# EAGLE design Engi301 Project Schematic (EAGLE 8.7.1)
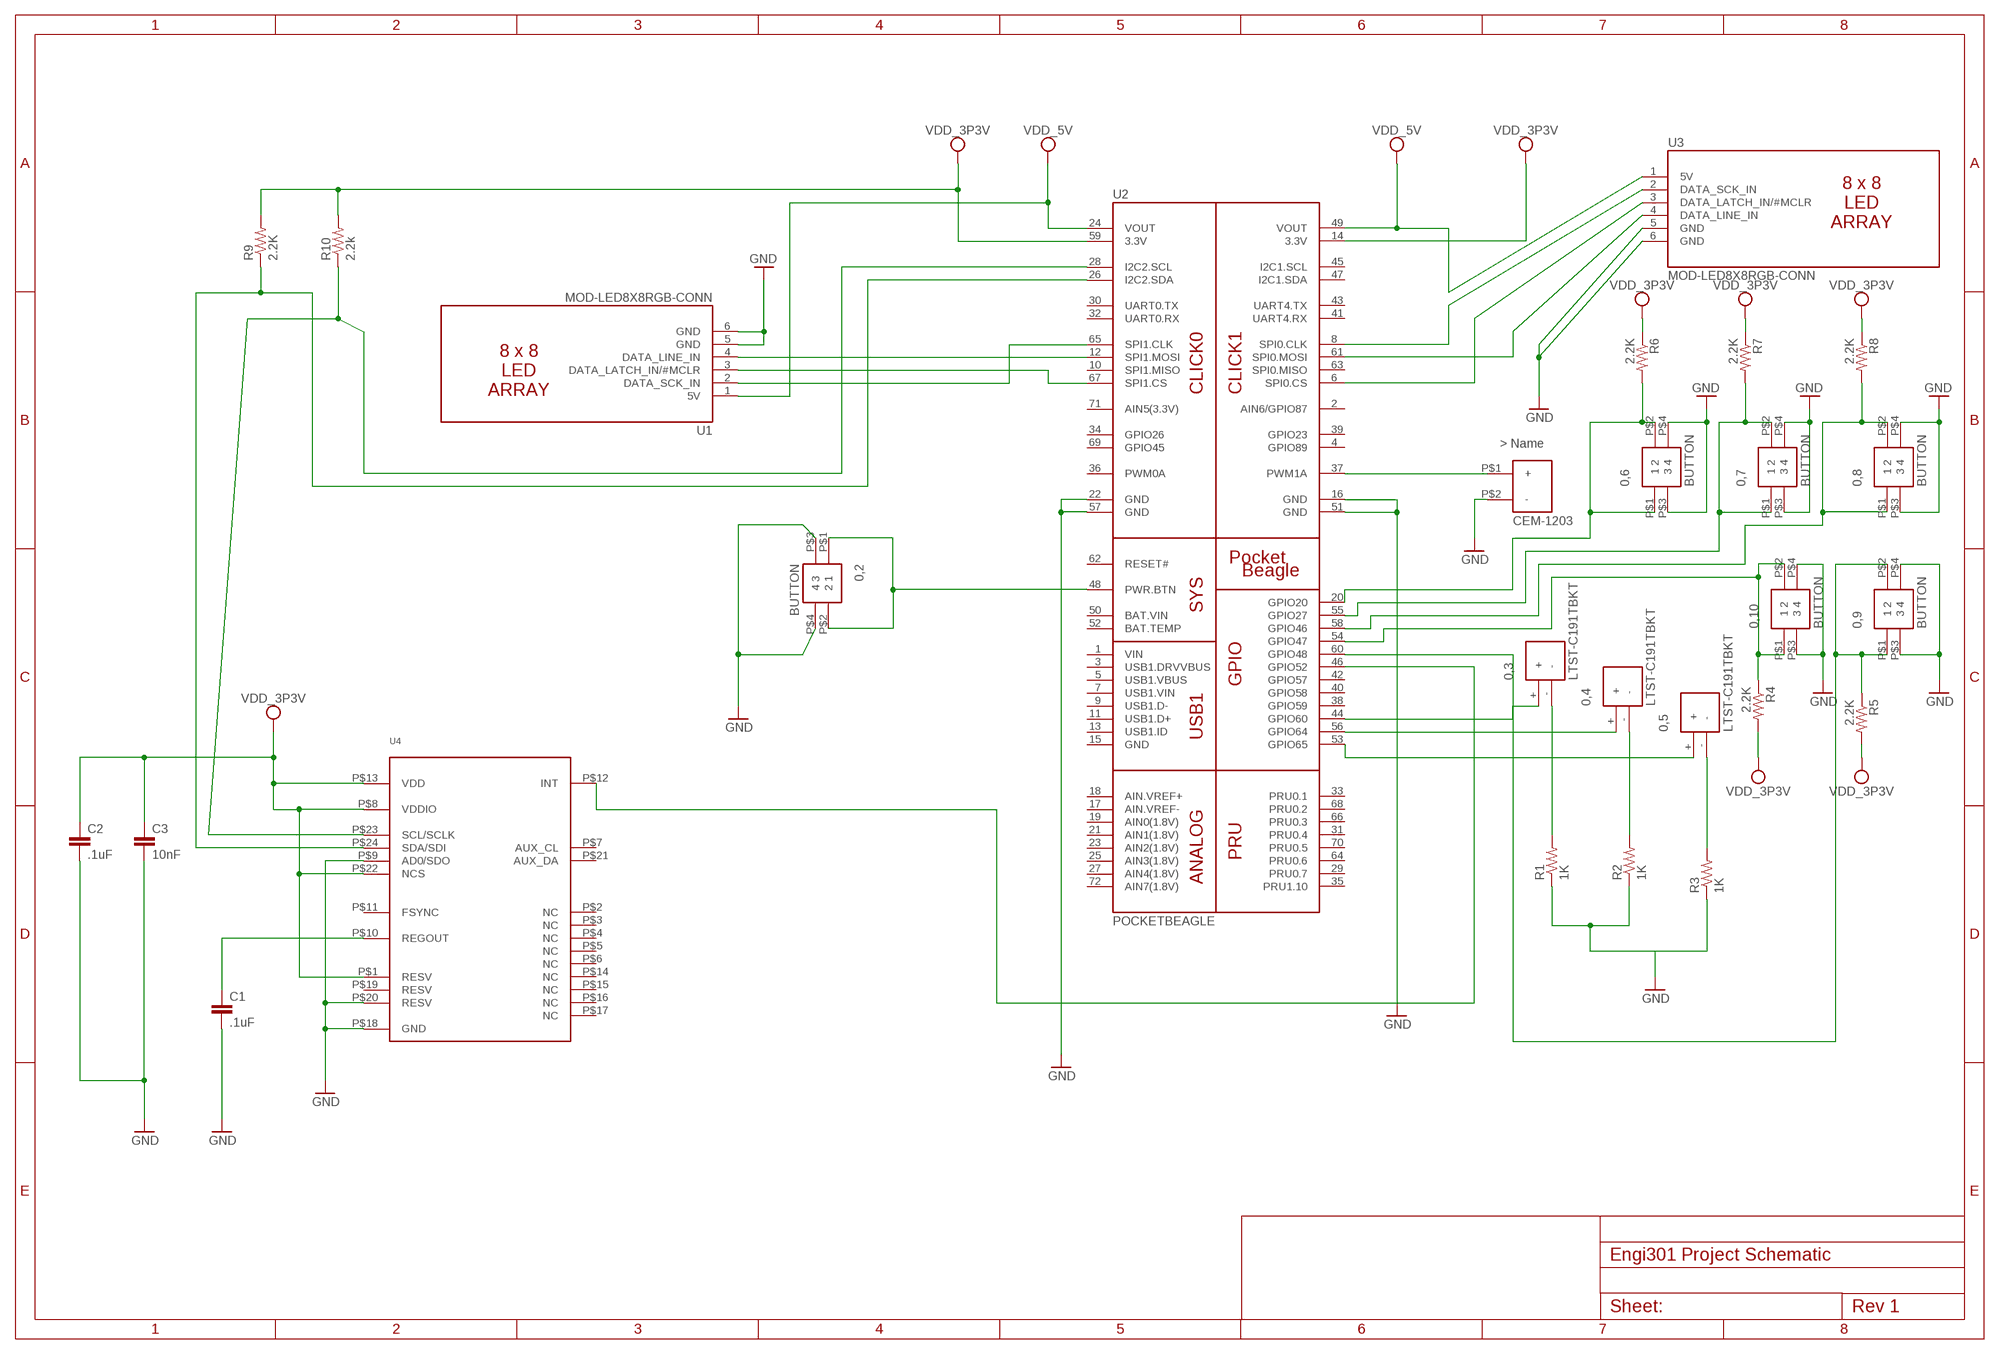
[diagram p0: schematic, sheet 1]

## Parts
0,1  CEM-1203  [CEM-1203]
0,2  BUTTON  [BUTTON]
0,3  LTST-C191TBKT  [LTST_C191TBKT]
0,4  LTST-C191TBKT  [LTST_C191TBKT]
0,5  LTST-C191TBKT  [LTST_C191TBKT]
0,6  BUTTON  [BUTTON]
0,7  BUTTON  [BUTTON]
0,8  BUTTON  [BUTTON]
0,9  BUTTON  [BUTTON]
0,10  BUTTON  [BUTTON]
C1  .1uF  C_C0603  [C0603]
C2  .1uF  C_C0603  [C0603]
C3  10nF  C_C0402  [C0402]
R1  1K  R_R0603  [R0603]
R2  1K  R_R0603  [R0603]
R3  1K  R_R0603  [R0603]
R4  2.2K  R_R0603  [R0603]
R5  2.2K  R_R0603  [R0603]
R6  2.2K  R_R0603  [R0603]
R7  2.2K  R_R0603  [R0603]
R8  2.2K  R_R0603  [R0603]
R9  2.2K  R_R0603  [R0603]
R10  2.2k  R_R0603  [R0603]
U1  MOD-LED8X8RGB-CONN  [FE06W]
U2  POCKETBEAGLE  [POCKETBEAGLE]
U3  MOD-LED8X8RGB-CONN  [FE06W]
U4  MPU-9250  [QFN_3MMX3MM]

## Nets
GND: 0,1.P$2(-) 0,2.P$3 0,2.P$4 0,6.P$3 0,6.P$4 0,7.P$3 0,7.P$4 0,8.P$3 0,8.P$4 0,9.P$3 0,9.P$4 0,10.P$3 0,10.P$4 C1.2 C2.2 C3.2 R1.1 R2.1 R3.1 U1.5(GND) U1.6(GND) U2.16(GND) U2.22(GND) U2.51(GND) U2.57(GND) U3.5(GND) U3.6(GND) U4.P$9(AD0/SDO) U4.P$18(GND) U4.P$20(RESV)
N$1: R10.1 U2.28(I2C2.SCL) U4.P$23(SCL/SCLK)
N$2: U2.8(SPI0.CLK) U3.2(DATA_SCK_IN)
N$3: U2.61(SPI0.MOSI) U3.4(DATA_LINE_IN)
N$4: C1.1 U4.P$10(REGOUT)
N$5: 0,5.+ U2.53(GPIO65)
N$6: U1.2(DATA_SCK_IN) U2.65(SPI1.CLK)
N$7: U1.4(DATA_LINE_IN) U2.12(SPI1.MOSI)
N$8: U1.3(DATA_LATCH_IN/#MCLR) U2.67(SPI1.CS)
N$9: 0,4.+ U2.56(GPIO64)
N$10: 0,3.+ U2.44(GPIO60)
N$11: 0,1.P$1(+) U2.37(PWM1A)
N$12: U2.46(GPIO52) U4.P$12(INT)
N$13: 0,2.P$1 0,2.P$2 U2.48(PWR.BTN)
N$14: 0,3.- R1.2
N$15: 0,4.- R2.2
N$16: 0,5.- R3.2
N$17: U2.6(SPI0.CS) U3.3(DATA_LATCH_IN/#MCLR)
N$18: R9.1 U2.26(I2C2.SDA) U4.P$24(SDA/SDI)
N$19: 0,6.P$1 0,6.P$2 R6.2 U2.20(GPIO20)
N$20: 0,7.P$1 0,7.P$2 R7.2 U2.55(GPIO27)
N$21: 0,8.P$1 0,8.P$2 R8.2 U2.58(GPIO46)
N$22: 0,10.P$1 0,10.P$2 R4.1 U2.54(GPIO47)
N$23: 0,9.P$1 0,9.P$2 R5.1 U2.60(GPIO48)
SYS_VDD1_3P3V: C2.1 C3.1 R4.2 R5.2 R6.1 R7.1 R8.1 R9.2 R10.2 U2.14(3.3V) U2.59(3.3V) U4.P$1(RESV) U4.P$8(VDDIO) U4.P$13(VDD) U4.P$22(NCS) ; supply symbol labelled VDD_3P3V
SYS_VDD_5V: U1.1(5V) U2.24(VOUT) U2.49(VOUT) U3.1(5V) ; supply symbol labelled VDD_5V
Unconnected: U2.1(VIN) U2.2(AIN6/GPIO87) U2.3(USB1.DRVVBUS) U2.4(GPIO89) U2.5(USB1.VBUS) U2.7(USB1.VIN) U2.9(USB1.D-) U2.10(SPI1.MISO) U2.11(USB1.D+) U2.13(USB1.ID) U2.15(GND) U2.17(AIN.VREF-) U2.18(AIN.VREF+) U2.19(AIN0(1.8V)) U2.21(AIN1(1.8V)) U2.23(AIN2(1.8V)) U2.25(AIN3(1.8V)) U2.27(AIN4(1.8V)) U2.29(PRU0.7) U2.30(UART0.TX) U2.31(PRU0.4) U2.32(UART0.RX) U2.33(PRU0.1) U2.34(GPIO26) U2.35(PRU1.10) U2.36(PWM0A) U2.38(GPIO59) U2.39(GPIO23) U2.40(GPIO58) U2.41(UART4.RX) U2.42(GPIO57) U2.43(UART4.TX) U2.45(I2C1.SCL) U2.47(I2C1.SDA) U2.50(BAT.VIN) U2.52(BAT.TEMP) U2.62(RESET#) U2.63(SPI0.MISO) U2.64(PRU0.6) U2.66(PRU0.3) U2.68(PRU0.2) U2.69(GPIO45) U2.70(PRU0.5) U2.71(AIN5(3.3V)) U2.72(AIN7(1.8V)) U4.P$2(NC) U4.P$3(NC) U4.P$4(NC) U4.P$5(NC) U4.P$6(NC) U4.P$7(AUX_CL) U4.P$11(FSYNC) U4.P$14(NC) U4.P$15(NC) U4.P$16(NC) U4.P$17(NC) U4.P$19(RESV) U4.P$21(AUX_DA)

## Library data of the parts
0,1 = ENGI301_PCB_design_project:CEM-1203
0,2 0,6-0,10 = ENGI301_PCB_design_project:BUTTON
0,3-0,5 = ENGI301_PCB_design_project:LTST-C191TBKT
C1-C3 = ENGI301_PCB_design_project:C_: Capacitor SMD. Sizes: 0402, 0603 & 0805
R1-R10 = ENGI301_design_example:R_: RESISTOR, American symbol
U1 U3 = ENGI301_PCB_design_project:MOD-LED8X8RGB-CONN
U2 = ENGI301_PCB_design_project:POCKETBEAGLE
U4 = ENGI301_PCB_design_project:MPU-9250

## Board
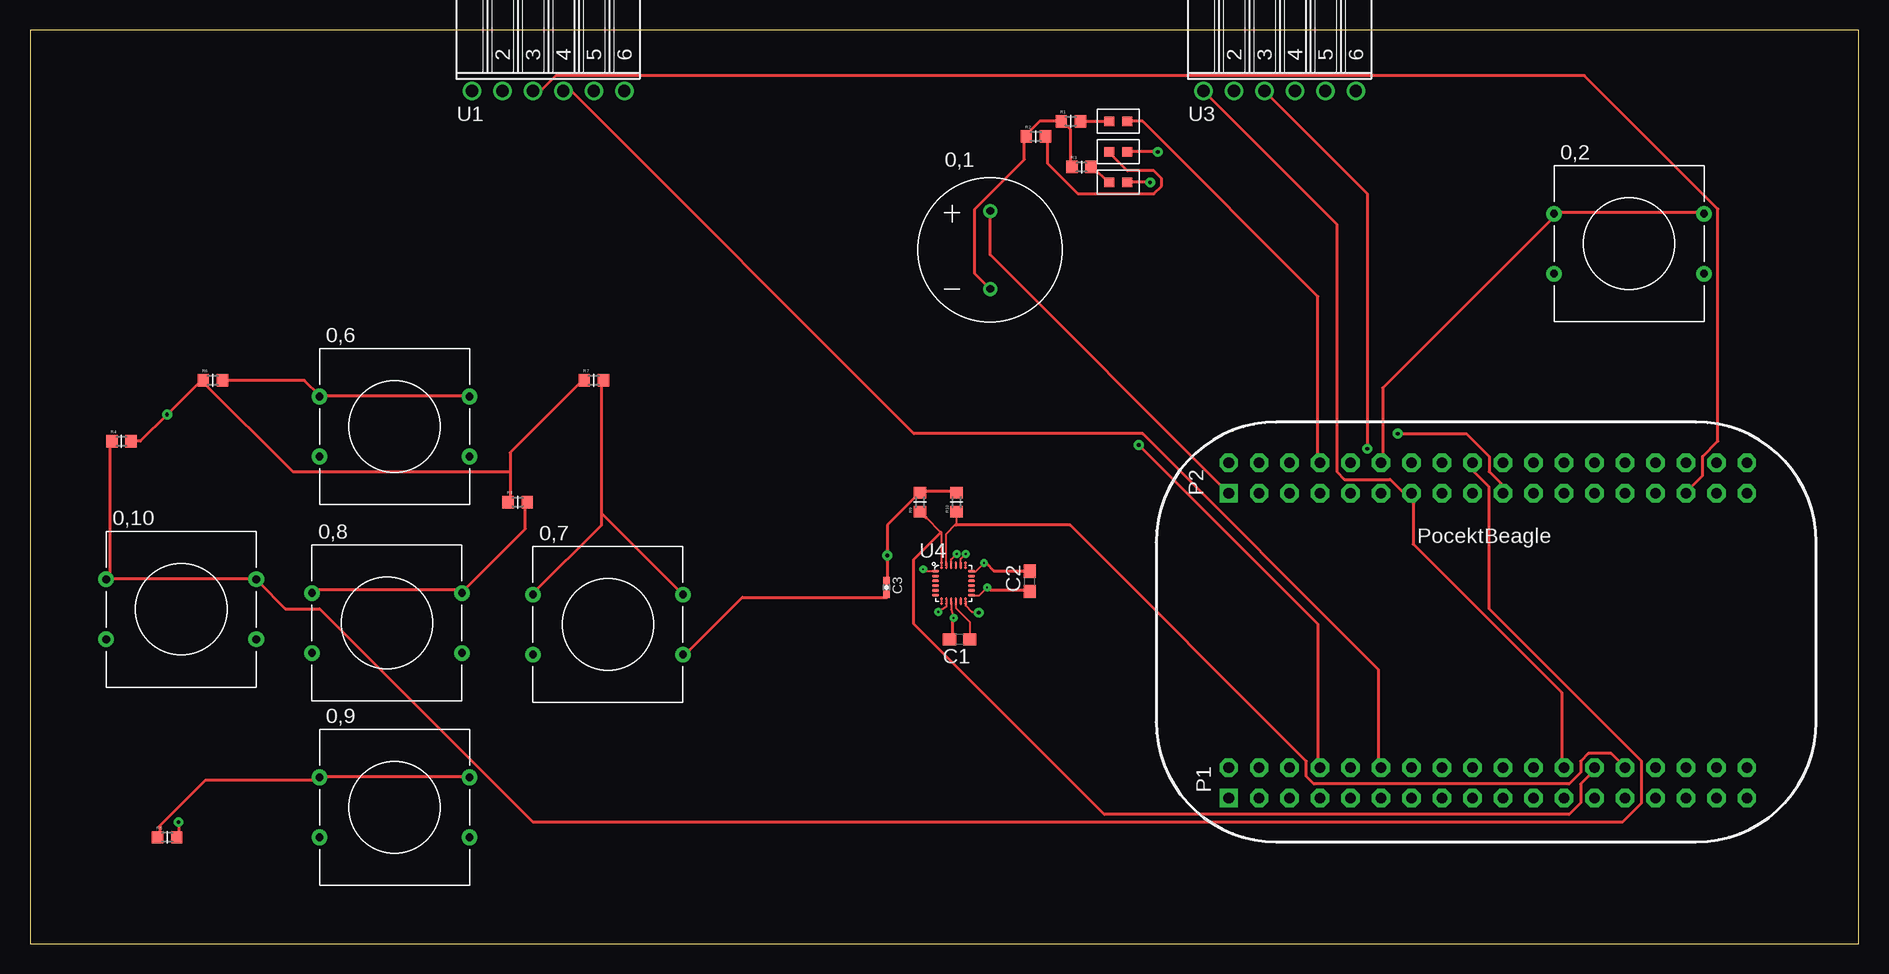
[diagram p1: board, top side]
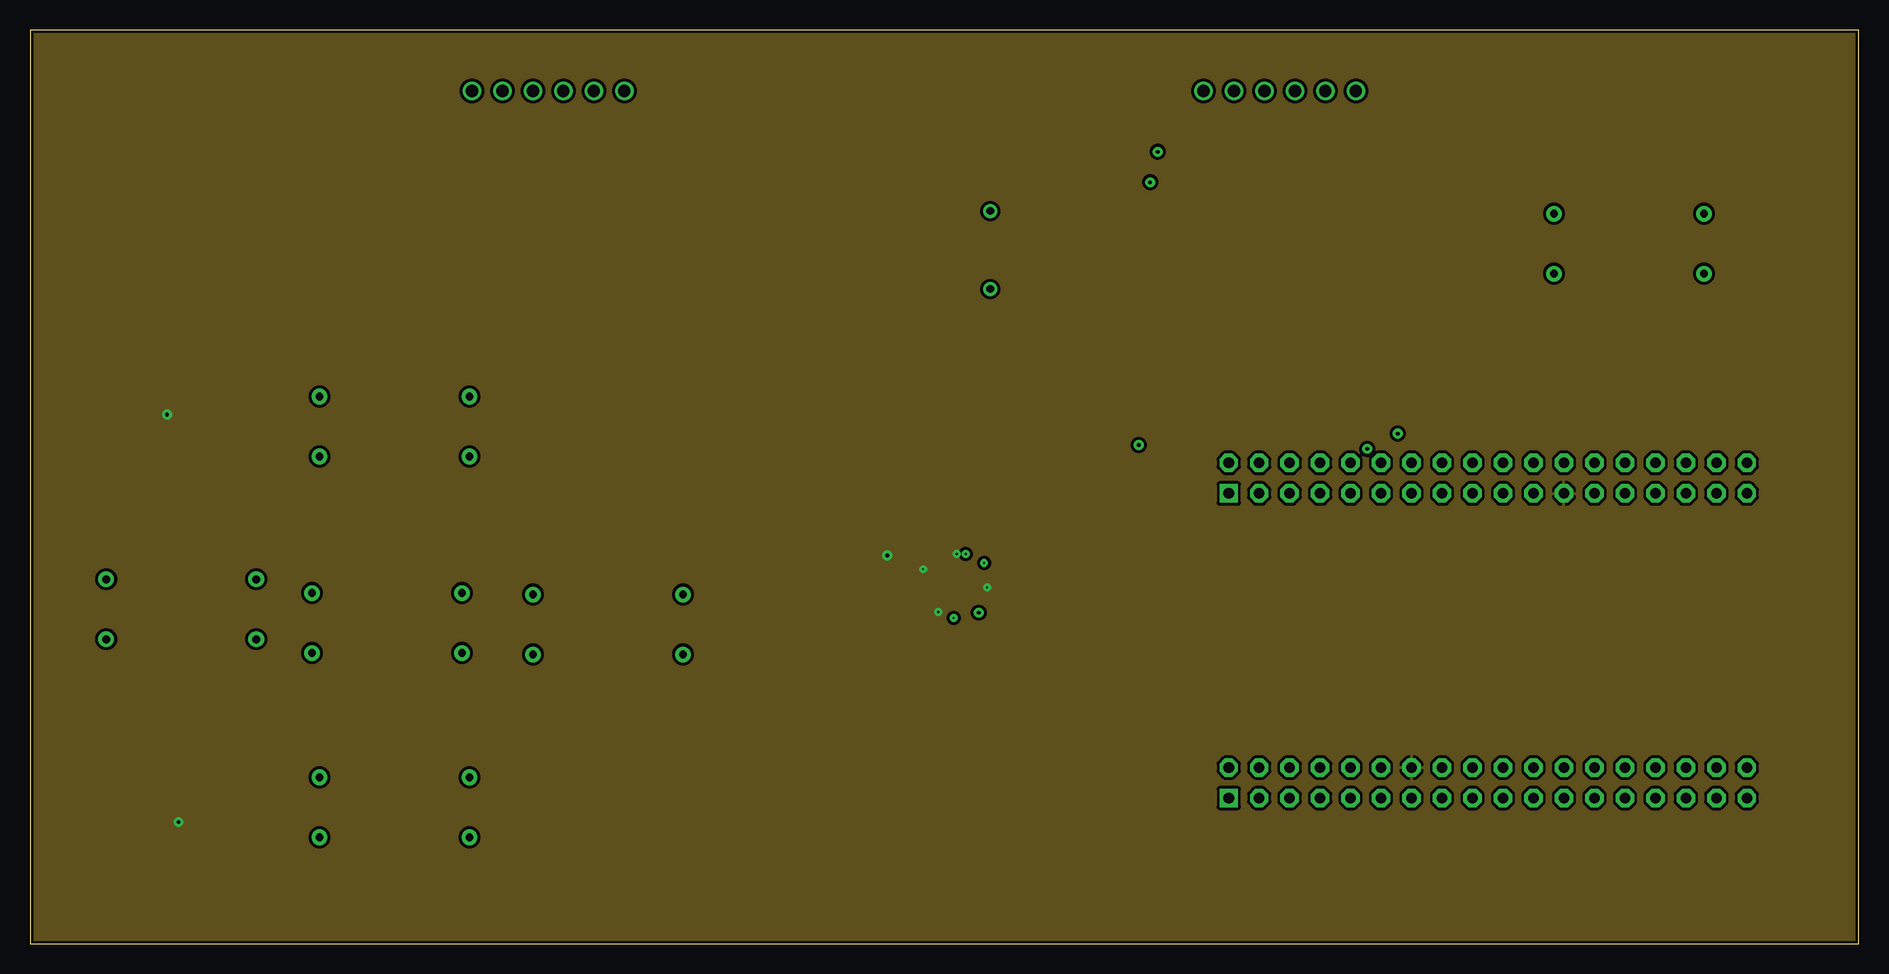
[diagram p2: board, inner layer Route2]
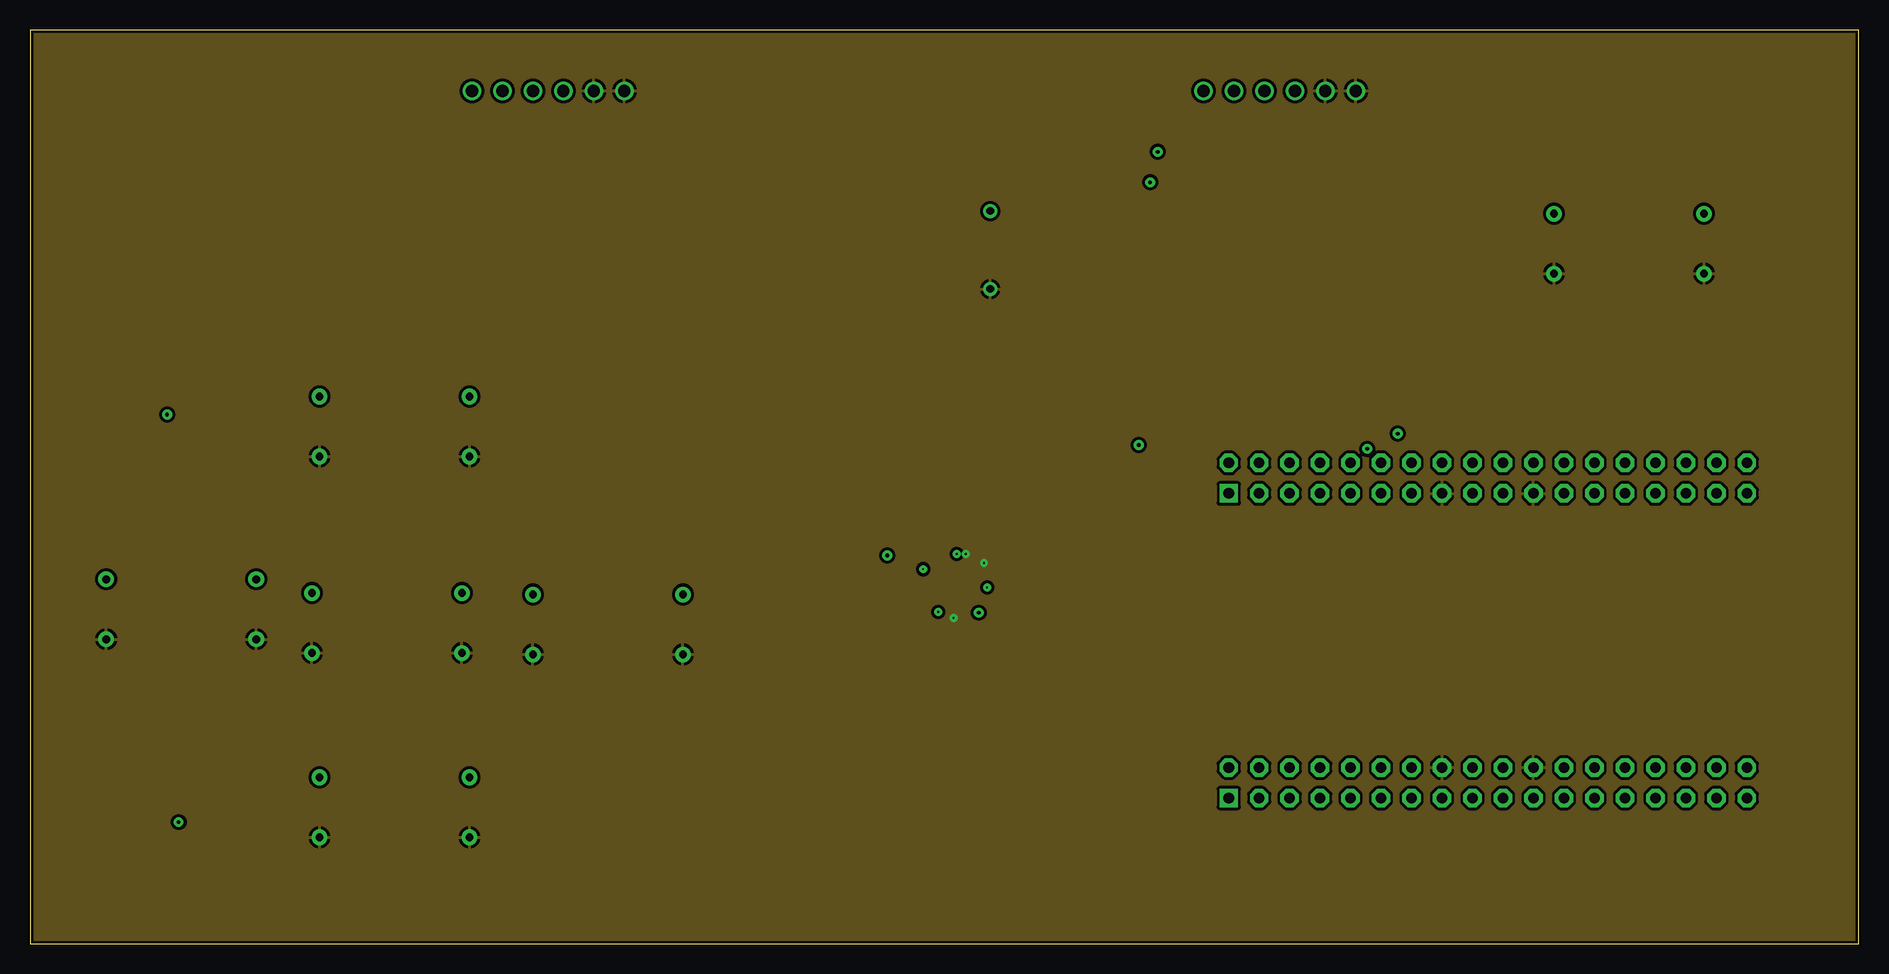
[diagram p3: board, inner layer Route15]
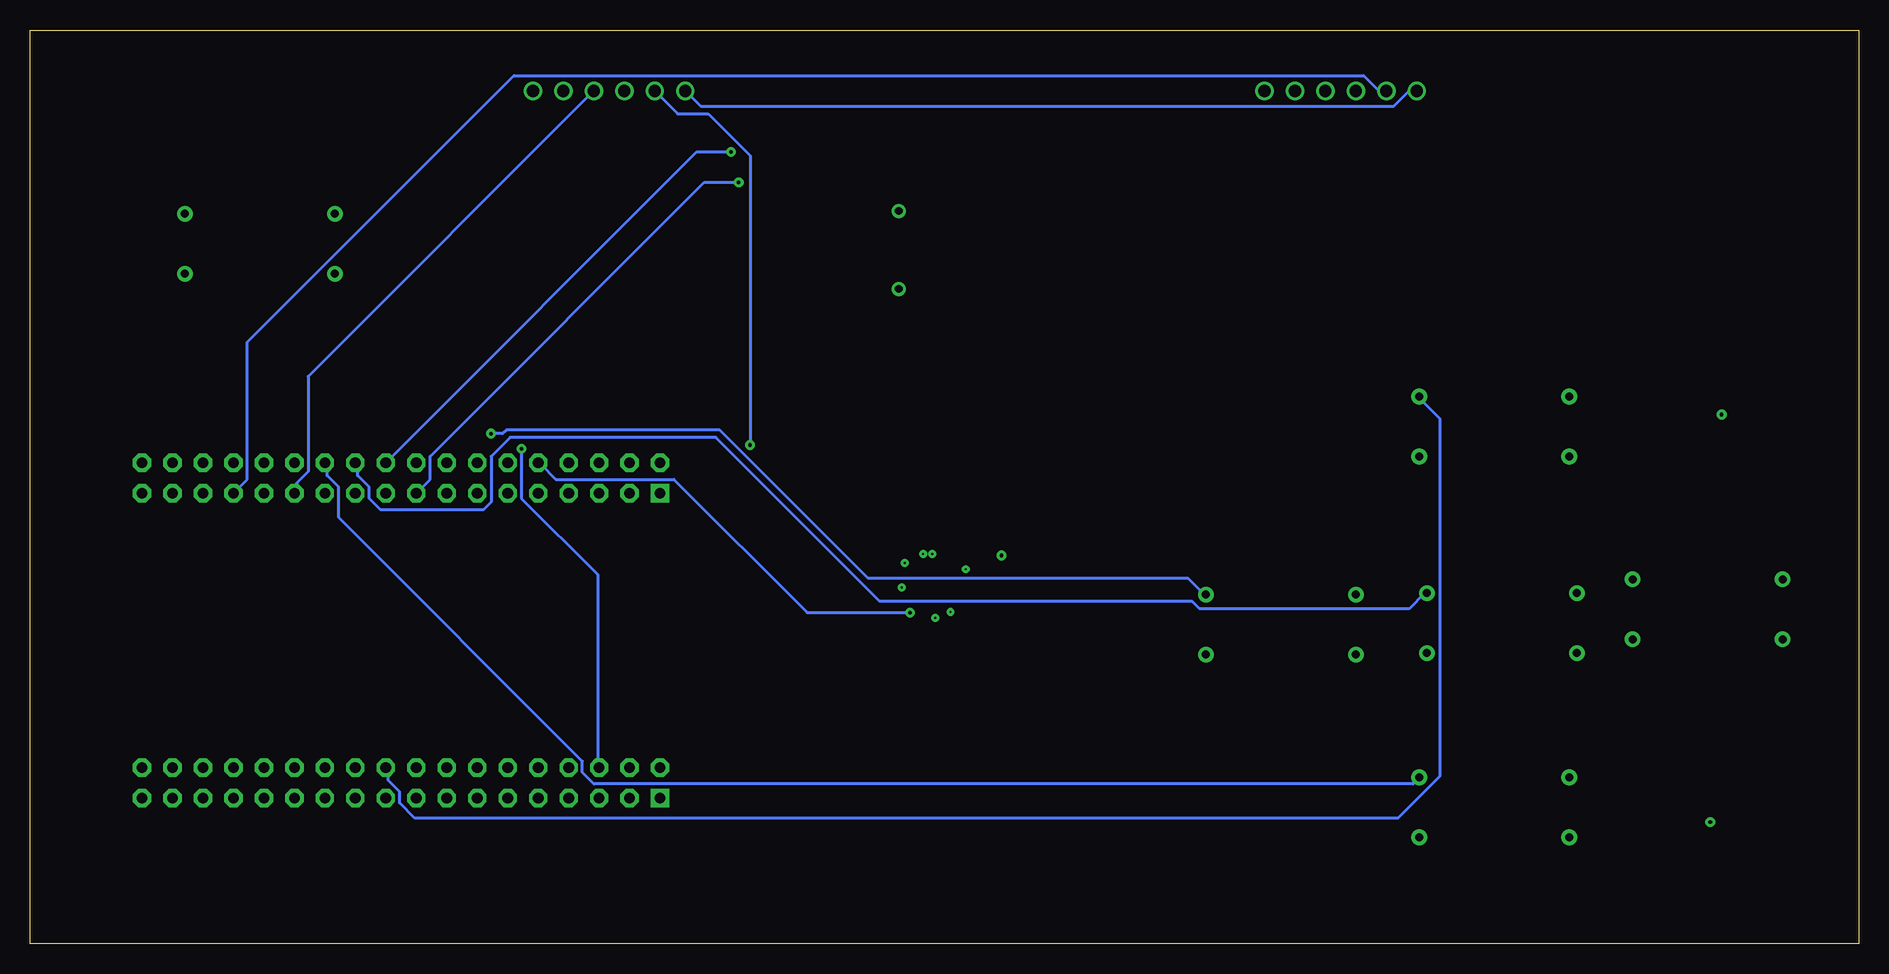
[diagram p4: board, bottom side, seen from below]

Size 152.4 x 76.2 mm. Coordinates in mm from the lower left corner, seen from the top.
Outline: 0,0 152.4,0 152.4,76.2 0,76.2 0,0
Copper layers (1*2*15*16): Top 0.035mm / dielectric 0.23mm / Route2 0.035mm / dielectric 0.93mm / Route15 0.035mm / dielectric 0.23mm / Bottom 0.035mm
Design rules "ENGI301_Maze_Project_4lyr": minimum track width 10mil, minimum drill 12mil, track to track 10mil, track to pad 10mil, pad to pad 10mil, via to via 10mil, smd to smd 10mil, copper to edge 10mil, drill to drill 12mil, minimum pad ring 10mil, minimum via ring 10mil, stop-mask expansion 3mil, vias tented up to drill 25mil, thermal gap 10mil

### Footprints (pad centres in the part's own frame; a part is rotated, then mirrored left to right if it is on the bottom)
CEM-1203 = drill 0.65 pad 0.8: P$1 0,6.5; P$2 0,0
BUTTON = drill 0.65 pad 1.3: P$1 0,5; P$2 12.5,5; P$3 12.5,0; P$4 0,0
LTST_C191TBKT = smd 0.8 x 0.8: + 0,0; - 1.5,0
C0603 = smd 1.1 x 1: 1 -0.85,0; 2 0.85,0
C0402 = smd 0.61 x 0.508: 1 -0.559,0; 2 0.559,0
R0603 = smd 0.95 x 1.031: 1 -0.8,0; 2 0.8,0
FE06W = drill 1.016: 1 -6.35,0; 2 -3.81,0; 3 -1.27,0; 4 1.27,0; 5 3.81,0; 6 6.35,0
POCKETBEAGLE = drill 0.889 pad 1.524 square: 1 5.91,3.53; 37 5.91,28.93 | drill 0.889 pad 1.524 octagon: 2 5.91,6.07; 3 8.45,3.53; 4 8.45,6.07; 5 10.99,3.53; 6 10.99,6.07; 7 13.53,3.53; 8 13.53,6.07; 9 16.07,3.53; 10 16.07,6.07; 11 18.61,3.53; 12 18.61,6.07; 13 21.15,3.53; 14 21.15,6.07; 15 23.69,3.53; 16 23.69,6.07; 17 26.23,3.53; 18 26.23,6.07; 19 28.77,3.53; 20 28.77,6.07; 21 31.31,3.53; 22 31.31,6.07; 23 33.85,3.53; 24 33.85,6.07; 25 36.39,3.53; 26 36.39,6.07; 27 38.93,3.53; 28 38.93,6.07; 29 41.47,3.53; 30 41.47,6.07; 31 44.01,3.53; 32 44.01,6.07; 33 46.55,3.53; 34 46.55,6.07; 35 49.09,3.53; 36 49.09,6.07; 38 5.91,31.47; 39 8.45,28.93; 40 8.45,31.47; 41 10.99,28.93; 42 10.99,31.47; 43 13.53,28.93; 44 13.53,31.47; 45 16.07,28.93; 46 16.07,31.47; 47 18.61,28.93; 48 18.61,31.47; 49 21.15,28.93; 50 21.15,31.47; 51 23.69,28.93; 52 23.69,31.47; 53 26.23,28.93; 54 26.23,31.47; 55 28.77,28.93; 56 28.77,31.47; 57 31.31,28.93; 58 31.31,31.47; 59 33.85,28.93; 60 33.85,31.47; 61 36.39,28.93; 62 36.39,31.47; 63 38.93,28.93; 64 38.93,31.47; 65 41.47,28.93; 66 41.47,31.47; 67 44.01,28.93; 68 44.01,31.47; 69 46.55,28.93; 70 46.55,31.47; 71 49.09,28.93; 72 49.09,31.47
QFN_3MMX3MM = smd 0.6 x 0.2: P$1 -1.5,1.1; P$2 -1.5,0.7; P$3 -1.5,0.3; P$4 -1.5,-0.1; P$5 -1.5,-0.5; P$6 -1.5,-0.9; P$13 1.5,-0.9; P$14 1.5,-0.5; P$15 1.5,-0.1; P$16 1.5,0.3; P$17 1.5,0.7; P$18 1.5,1.1 | smd 0.2 x 0.6: P$7 -1,-1.4; P$8 -0.6,-1.4; P$9 -0.2,-1.4; P$10 0.2,-1.4; P$11 0.6,-1.4; P$12 1,-1.4; P$19 1,1.6; P$20 0.6,1.6; P$21 0.2,1.6; P$22 -0.2,1.6; P$23 -0.6,1.6; P$24 -1,1.6

### Placement (x,y rotation side)
0,1  80.01,54.61 0 top
0,2  127,55.88 0 top
0,3  91.44,68.58 180 top
0,4  91.44,66.04 180 top
0,5  91.44,63.5 180 top
0,6  24.13,40.64 0 top
0,7  41.91,24.13 0 top
0,8  23.5,24.26 0 top
0,9  24.13,8.89 0 top
0,10  6.35,25.4 0 top
C1  77.47,25.4 180 top
C2  83.31,30.23 90 top
C3  71.37,29.72 270 top
R1  86.74,68.58 0 top
R2  83.82,67.31 0 top
R3  87.63,64.77 0 top
R4  7.62,41.91 0 top
R5  11.43,8.89 0 top
R6  15.24,46.99 0 top
R7  46.99,46.99 0 top
R8  40.64,36.83 0 top
R9  74.17,36.83 90 top
R10  77.22,36.83 90 top
U1  43.18,71.12 0 top
U2  93.98,8.64 0 top
U3  104.14,71.12 0 top
U4  76.96,29.97 0 top

### Tracks (layer width: path | path; a pad name or v marks a point on that pad's centre or on a via)
GND  (via drill 0.15)
  Top 0.152: U4.P$9 76.76,27.89 v76.96,27.18 | U4.P$20 77.56,32.1 v77.98,32.51 | U4.P$18 78.82,31.07 v79.5,31.75
  Top 0.254: R3.1 86.68,64.77 86.68,67.94 86.04,68.58 R1.1 84.14,68.58 83.19,67.63 83.19,67.31 R2.1 82.87,67.31 82.87,65.41 78.74,61.28 78.74,55.88 0,1.P$2 | C3.2 71.44,28.89 59.37,28.89 54.61,24.13 0,7.P$3 | C1.2 76.83,25.4 76.83,26.99 v76.96,27.18 | C2.2 83.19,31.11 80.33,31.11 79.69,31.75 v79.5,31.75
  pour Route15: -5.08,-2.54 -5.08,81.28 157.48,81.28 157.48,-5.08 -5.08,-5.08
N$1
  Top 0.152: U4.P$23 76.36,34.2 77.12,34.96 77.22,35.05 R10.1
  Top 0.254: 77.12,34.96 77.15,34.92 86.68,34.92 106.36,15.24 106.36,13.97 107,13.34 128.27,13.34 129.22,14.29 129.22,15.24 129.86,15.88 131.76,15.88 132.72,14.92 U2.28
N$2  (via drill 0.3)
  Top 0.254: v92.39,41.59 107.31,26.67 107.31,14.92 U2.8
  Bottom 0.254: v92.39,41.59 92.39,65.72 95.89,69.22 98.42,69.22 U3.2
N$3
  Bottom 0.254: U3.4 129.22,47.31 129.22,39.37 130.18,38.42 130.18,37.78 U2.61
N$4
  Top 0.152: U4.P$10 77.16,27.99 78.32,26.84 C1.1
N$5  (via drill 0.3)
  Top 0.254: v93.34,63.5 0,5.+
  Bottom 0.254: v93.34,63.5 96.2,63.5 119.06,40.64 119.06,38.73 120.02,37.78 U2.53
N$6
  Bottom 0.254: U1.2 40.01,71.12 41.27,72.39 112.08,72.39 134.3,50.16 134.3,38.73 135.25,37.78 U2.65
N$7
  Top 0.254: U1.4 45.09,71.12 73.66,42.55 92.71,42.55 112.39,22.86 112.39,14.92 U2.12
N$8
  Top 0.254: U1.3 42.55,71.12 43.81,72.39 129.54,72.39 140.65,61.28 140.65,41.91 139.38,40.64 139.38,39.05 138.11,37.78 U2.67
N$9  (via drill 0.3)
  Top 0.254: v93.98,66.04 0,4.+
  Bottom 0.254: v93.98,66.04 96.84,66.04 122.56,40.32 U2.56
N$10
  Top 0.254: 0,3.+ 92.71,68.58 107.31,53.98 107.31,40.32 U2.44
N$11
  Top 0.254: 0,1.P$1 80.01,57.47 99.69,37.78 U2.37
N$12  (via drill 0.3)
  Top 0.152: U4.P$12 77.96,28.21 78.49,27.69 79.06,27.69 79.25,27.69
  Top 0.254: v79.06,27.62 79.06,27.69
  Bottom 0.254: v79.06,27.62 87.63,27.62 98.74,38.73 108.58,38.73 109.86,40.01 U2.46
N$13
  Top 0.254: 0,2.P$2 139.38,60.96 127,60.96 0,2.P$1 127,60.64 112.71,46.35 112.71,40.32 U2.48
N$14
  Top 0.254: R1.2 0,3.-
N$15
  Top 0.254: 0,4.- 90.17,66.04 90.17,65.72 91.44,64.45 93.66,64.45 94.3,63.82 94.3,63.18 93.66,62.55 87.31,62.55 84.77,65.09 84.77,67.31 R2.2
N$16
  Top 0.254: 0,5.- 89.85,63.5 88.58,64.77 R3.2
N$17  (via drill 0.3)
  Top 0.254: v111.44,41.27 111.44,62.55 U3.3
  Bottom 0.254: v111.44,41.27 111.44,37.15 105.09,30.8 105.09,14.92 U2.6
N$18
  Top 0.152: U4.P$24 75.96,34.27 75.91,34.32 74.68,35.56
  Top 0.254: R9.1 74.3,35.88 74.61,35.56 74.68,35.56 | 75.91,34.32 73.66,32.07 73.66,26.67 89.53,10.79 128.27,10.79 129.22,11.75 129.22,13.34 130.49,14.61 U2.26
N$19
  Top 0.254: R6.2 22.86,46.99 24.13,45.72 | 24.13,45.72 36.51,45.72 0,6.P$2 | 24.13,45.72 0,6.P$1
  Bottom 0.254: U2.20 122.56,14.61 122.56,13.65 121.6,12.7 121.6,11.75 120.33,10.48 38.42,10.48 34.92,13.97 34.92,43.81 36.51,45.4 0,6.P$2
N$20  (via drill 0.3)
  Top 0.254: 47.62,35.88 47.62,34.92 41.91,29.21 0,7.P$1 | 47.62,35.88 47.62,46.99 R7.2 | 47.62,35.88 54.29,29.21 0,7.P$2 | v113.98,42.55 119.7,42.55 121.6,40.64 121.6,39.37 122.56,38.42 122.56,37.78 U2.55
  Bottom 0.254: v113.98,42.55 113.03,42.55 112.71,42.86 94.93,42.86 82.55,30.48 55.88,30.48 54.61,29.21 0,7.P$2
N$21
  Top 0.254: R8.2 41.27,36.83 41.27,34.61 36.2,29.53 0,8.P$2 35.88,29.53 23.5,29.53 0,8.P$1
  Bottom 0.254: U2.58 125.09,40.01 125.09,39.05 124.14,38.1 124.14,37.15 123.19,36.2 114.62,36.2 113.98,36.83 113.98,40.64 112.39,42.23 95.25,42.23 81.6,28.57 55.56,28.57 54.93,27.94 37.47,27.94 36.2,29.21 0,8.P$2
N$22
  Top 0.254: 6.35,30.48 6.67,30.8 6.67,41.91 R4.1 | 6.35,30.48 18.73,30.48 0,10.P$2 19.05,30.16 21.27,27.94 24.13,27.94 41.91,10.16 132.72,10.16 134.3,11.75 134.3,15.24 121.6,27.94 121.6,38.1 120.33,39.37 120.33,40.01 U2.54 | 6.35,30.48 0,10.P$1
N$23
  Top 0.254: R5.1 10.79,8.89 10.79,9.84 14.61,13.65 24.13,13.65 0,9.P$1 24.13,13.97 36.51,13.97 0,9.P$2
  Bottom 0.254: U2.60 127.64,40.01 127.64,39.05 126.68,38.1 126.68,35.56 106.36,15.24 106.36,14.29 105.41,13.34 37.15,13.34 36.83,13.65 0,9.P$2
SYS_VDD1_3P3V  (via drill 0.15, 0.3)
  Top 0.152: U4.P$8 76.36,28.1 v75.69,27.69 | U4.P$1 74.59,31.07 v74.42,31.24 | U4.P$22 76.76,32.06 v77.22,32.51 | U4.P$13 79.11,29.07 v79.76,29.72
  Top 0.254: 40.01,39.37 40.01,40.96 46.04,46.99 R7.1 | 40.01,39.37 40.01,36.83 R8.1 | C3.1 71.44,30.48 v71.44,32.38 71.44,34.92 73.98,37.47 R9.2 74.3,37.78 77.15,37.78 R10.2 | R4.2 9.21,41.91 v11.43,44.13 14.29,46.99 | v12.38,10.16 12.38,8.89 R5.2 | C2.1 83.19,29.53 80.01,29.53 v79.76,29.72 | 40.01,39.37 21.91,39.37 14.29,46.99 | 14.29,46.99 R6.1
  pour Route2: -2.54,-2.54 154.94,-2.54 154.94,78.74 -2.54,78.74
SYS_VDD_5V
  Top 0.254: U2.24 127.64,14.92 127.64,20.95 115.25,33.34 115.25,37.47 U2.49 114.94,37.78 114.3,37.78 113.35,38.73 109.54,38.73 108.9,39.37 108.9,60.01 U3.1
  Bottom 0.254: U1.1 37.47,71.12 38.73,69.85 96.52,69.85 U3.1